# Altium schematic sheet Sheet0-mcu.SchDoc
size A3; SheetNumber: 1; SheetTotal: 2
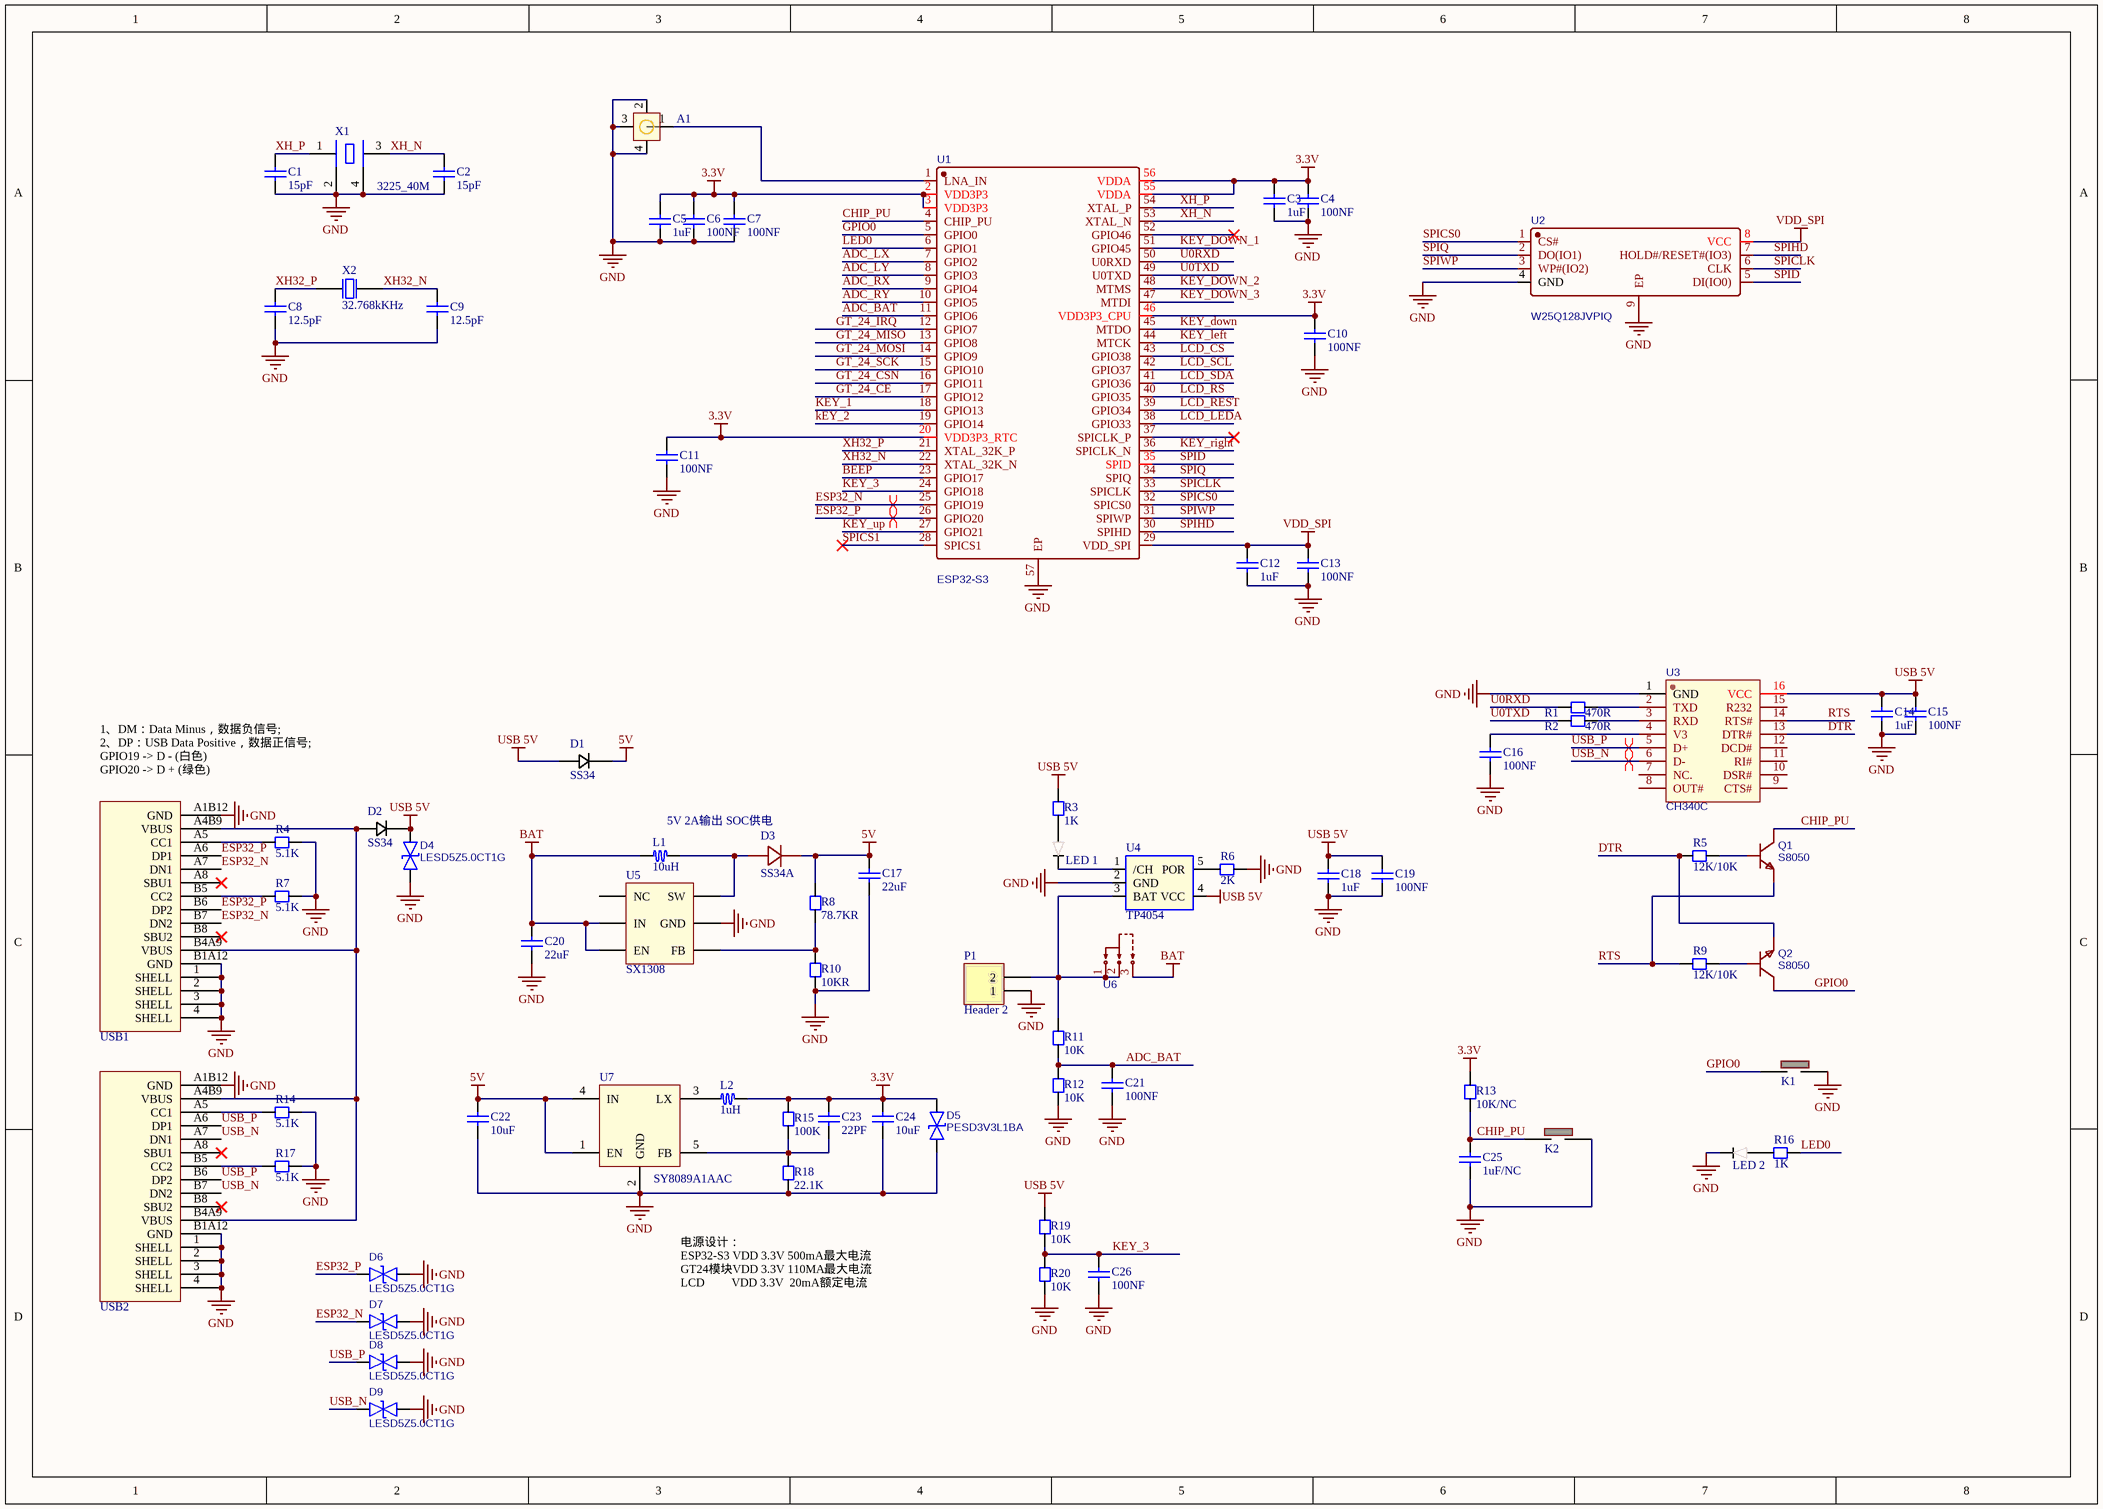
[diagram p0: Sheet0-mcu.SchDoc]

## Parts
A1  ANT-IPEX  [ANT-IPEX]  (value not drawn)
C1  15pF  [CC1608-0603]
C2  15pF  [CC1608-0603]
C3  1uF  [CC1608-0603]
C4  100NF  [CC1608-0603]
C5  1uF  [CC1608-0603]
C6  100NF  [CC1608-0603]
C7  100NF  [CC1608-0603]
C8  12.5pF  [CC1608-0603]
C9  12.5pF  [CC1608-0603]
C10  100NF  [CC1608-0603]
C11  100NF  [CC1608-0603]
C12  1uF  [CC1608-0603]
C13  100NF  [CC1608-0603]
C14  1uF  [CC1608-0603]
C15  100NF  [CC1608-0603]
C16  100NF  [CC1608-0603]
C17  22uF  [CC1608-0603]
C18  1uF  [CC1608-0603]
C19  100NF  [CC1608-0603]
C20  22uF  [CC1608-0603]
C21  100NF  [CC1608-0603]
C22  10uF  [CC1608-0603]
C23  22PF  [CC1608-0603]
C24  10uF  [CC1608-0603]
C25  1uF/NC  [CC1608-0603]
C26  100NF  [CC1608-0603]
D1  SS34  [DO-214 AA]
D2  SS34  [DO-214 AA]
D3  SS34A  [DO-214 AA SMB]
D4  LESD5Z5.0CT1G  [SOD-523]
D5  PESD3V3L1BA  [SOD-323]
D6  LESD5Z5.0CT1G  [SOD-523]
D7  LESD5Z5.0CT1G  [SOD-523]
D8  LESD5Z5.0CT1G  [SOD-523]
D9  LESD5Z5.0CT1G  [SOD-523]
K1  KEY 3*4  [KEY 3*4]  (value not drawn)
K2  KEY 3*4  [KEY 3*4]  (value not drawn)
L1  10uH  [Inductor-6045]
L2  1uH  [Inductor-4018]
LED_1  LED 0603  [LED 0603]  (value not drawn)
LED_2  LED 0603  [LED 0603]  (value not drawn)
P1  Header 2  [HX2.54-2]
Q1  S8050  [SOT-23]
Q2  S8050  [SOT-23]
R1  470R  [CR1608-0603]
R2  470R  [CR1608-0603]
R3  1K  [CR1608-0603]
R4  5.1K  [CR1608-0603]
R5  12K/10K  [CR1608-0603]
R6  2K  [CR1608-0603]
R7  5.1K  [CR1608-0603]
R8  78.7KR  [CR1608-0603]
R9  12K/10K  [CR1608-0603]
R10  10KR  [CR1608-0603]
R11  10K  [CR1608-0603]
R12  10K  [CR1608-0603]
R13  10K/NC  [CR1608-0603]
R14  5.1K  [CR1608-0603]
R15  100K  [CR1608-0603]
R16  1K  [CR1608-0603]
R17  5.1K  [CR1608-0603]
R18  22.1K  [CR1608-0603]
R19  10K  [CR1608-0603]
R20  10K  [CR1608-0603]
U1  ESP32-S3  [QFN-56]
U2  W25Q128JVPIQ  [WSON-8]
U3  CH340C  [SOP-16]
U4  TP4054  [SOT23-5]
U5  SX1308  [SOT23-6]
U6  HX SS12D10G4  [SW-TH_3P-SS12D06]  (value not drawn)
U7  SY8089A1AAC  [SOT23-5]
USB1  Tpye-c 16P  [TYPE-C 16P]  (value not drawn)
USB2  Tpye-c 16P  [TYPE-C 16P]  (value not drawn)
X1  3225_40M  [XTAL-3225]
X2  32.768kKHz  [XTAL-3215]

## Nets
3.3V: C3.2 C4.2 C5.2 C6.2 C7.2 C10.2 C11.2 C23.2 C24.2 D5.1 L2.2 R13.2 R15.1 U1.2(VDD3P3) U1.3(VDD3P3) U1.20(VDD3P3_RTC) U1.46(VDD3P3_CPU) U1.55(VDDA) U1.56(VDDA)
5V: C17.1 C22.2 D1.1(K) D3.1(C) R8.2 U7.1(EN) U7.4(IN)
BAT: C20.2 L1.1 U5.4(EN) U5.5(IN) U6.3
GND: A1.2 A1.3 A1.4 C1.1 C2.1 C3.1 C4.1 C5.1 C6.1 C7.1 C8.1 C9.1 C10.1 C11.1 C12.1 C13.1 C14.1 C15.1 C16.1 C17.2 C18.1 C19.1 C20.1 C21.1 C22.1 C24.1 C25.1 C26.1 D4.2 D5.2 D6.2 D7.2 D8.2 D9.2 K1.2 K2.2 LED_2.2 P1.1 R4.1 R6.2 R7.1 R10.1 R12.1 R14.1 R17.1 R18.2 R20.1 U1.57(EP) U2.4(GND) U2.9(EP) U3.1(GND) U4.2(GND) U5.2(GND) U7.2(GND) USB1.1(SHELL) USB1.2(SHELL) USB1.3(SHELL) USB1.4(SHELL) USB1.A1B12(GND) USB1.B1A12(GND) USB2.1(SHELL) USB2.2(SHELL) USB2.3(SHELL) USB2.4(SHELL) USB2.A1B12(GND) USB2.B1A12(GND) X1.2(GND) X1.4(GND)
USB 5V: C14.2 C15.2 C18.2 C19.2 D1.2(A) D2.1(K) D4.1 R3.1 R19.2 U3.16(VCC) U4.4(VCC)
VDD_SPI: C12.2 C13.2 U1.29(VDD_SPI) U2.8(VCC)
ADC_BAT: C21.2 R11.1 R12.2 U1.11(GPIO6)
ADC_LX: U1.7(GPIO2)
ADC_LY: U1.8(GPIO3)
ADC_RX: U1.9(GPIO4)
ADC_RY: U1.10(GPIO5)
BEEP: U1.23(GPIO17)
CHIP_PU: C25.2 K2.1 Q1.3(C) R13.1 U1.4(CHIP_PU)
DTR: Q2.2(E) R5.1 U3.13(DTR#)
ESP32_N: D7.1 U1.25(GPIO19) USB1.A7(DN1) USB1.B7(DN2)
ESP32_P: D6.1 U1.26(GPIO20) USB1.A6(DP1) USB1.B6(DP2)
GPIO0: K1.1 Q2.3(C) U1.5(GPIO0)
GT_24_CE: U1.17(GPIO12)
GT_24_CSN: U1.16(GPIO11)
GT_24_IRQ: U1.12(GPIO7)
GT_24_MISO: U1.13(GPIO8)
GT_24_MOSI: U1.14(GPIO9)
GT_24_SCK: U1.15(GPIO10)
KEY_1: U1.18(GPIO13)
kEY_2: U1.19(GPIO14)
KEY_3: C26.2 R19.1 R20.2 U1.24(GPIO18)
KEY_down: U1.45(MTDO)
KEY_DOWN_1: U1.51(GPIO45)
KEY_DOWN_2: U1.48(MTMS)
KEY_DOWN_3: U1.47(MTDI)
KEY_left: U1.44(MTCK)
KEY_right: U1.36(SPICLK_N)
KEY_up: U1.27(GPIO21)
LCD_CS: U1.43(GPIO38)
LCD_LEDA: U1.38(GPIO33)
LCD_REST: U1.39(GPIO34)
LCD_RS: U1.40(GPIO35)
LCD_SCL: U1.42(GPIO37)
LCD_SDA: U1.41(GPIO36)
LED0: R16.1 U1.6(GPIO1)
RTS: Q1.2(E) R9.1 U3.14(RTS#)
SPICLK: U1.33(SPICLK) U2.6(CLK)
SPICS0: U1.32(SPICS0) U2.1(CS#)
SPICS1: U1.28(SPICS1)
SPID: U1.35(SPID) U2.5(DI(IO0))
SPIHD: U1.30(SPIHD) U2.7(HOLD#/RESET#(IO3))
SPIQ: U1.34(SPIQ) U2.2(DO(IO1))
SPIWP: U1.31(SPIWP) U2.3(WP#(IO2))
U0RXD: R1.2 U1.50(U0RXD)
U0TXD: R2.2 U1.49(U0TXD)
USB_N: D9.1 U3.6(D-) USB2.A7(DN1) USB2.B7(DN2)
USB_P: D8.1 U3.5(D+) USB2.A6(DP1) USB2.B6(DP2)
XH32_N: C9.2 U1.22(XTAL_32K_N) X2.2(OSC2)
XH32_P: C8.2 U1.21(XTAL_32K_P) X2.1(OSC1)
XH_N: C2.2 U1.53(XTAL_N) X1.3(OSC2)
XH_P: C1.2 U1.54(XTAL_P) X1.1(OSC1)
NetA1_1: A1.1 U1.1(LNA_IN)
NetC16_2: C16.2 U3.4(V3)
NetC23_1: C23.1 R15.2 R18.1 U7.5(FB)
NetD2_2: D2.2(A) USB1.A4B9(VBUS) USB1.B4A9(VBUS) USB2.A4B9(VBUS) USB2.B4A9(VBUS)
NetD3_2: D3.2(A) L1.2 U5.1(SW)
NetL2_1: L2.1 U7.3(LX)
NetLED_1_1: LED_1.1 R3.2
NetLED_1_2: LED_1.2 U4.1(/CH)
NetLED_2_1: LED_2.1 R16.2
NetP1_2: P1.2 R11.2 U4.3(BAT) U6.1 U6.2
NetQ1_1: Q1.1(B) R5.2
NetQ2_1: Q2.1(B) R9.2
NetR1_1: R1.1 U3.2(TXD)
NetR2_1: R2.1 U3.3(RXD)
NetR4_2: R4.2 USB1.A5(CC1)
NetR6_1: R6.1 U4.5(POR)
NetR7_2: R7.2 USB1.B5(CC2)
NetR8_1: R8.1 R10.2 U5.3(FB)
NetR14_2: R14.2 USB2.A5(CC1)
NetR17_2: R17.2 USB2.B5(CC2)

Not connected (* = marked no-connect by the designer): U1 37(SPICLK_P)* 52(GPIO46)*; U3 7(NC.) 8(OUT#) 9(CTS#) 10(DSR#) 11(RI#) 12(DCD#) 15(R232); U5 6(NC); USB1 A8(SBU1)* B8(SBU2)*; USB2 A8(SBU1)* B8(SBU2)*

## Layout directives
differential pair: ESP32_N, ESP32_P, USB_N, USB_P

## Notes on the sheet
- 1、DM：Data Minus，数据负信号;
  2、DP：USB Data Positive，数据正信号;
  GPIO19 -> D - (白色)
  GPIO20 -> D + (绿色)
- 5V 2A输出 SOC供电
- 电源设计：
  ESP32-S3 VDD 3.3V 500mA最大电流
  GT24模块VDD 3.3V 110MA最大电流
  LCD         VDD 3.3V  20mA额定电流

## Library data of the parts
A1 = ANT-IPEX: 贴片封装的天线 封装类型为IPEX
C1-C16 C18-C26 = Cap Chip 0603: 0603封装的电容; Published: 8-Jun-2000; Revision: July-2002: Re-released for DXP Platform.; Publisher: Altium Limited
C17 = Chip capacitor: 贴片电容
D1 D2 = SS34: 肖特基二极管
D3 = SS34A: 大电流肖特基二极管，5A/40V
D4 D6-D9 = LESD5Z5.0CT1G: SOD-523 ESD防静电二极管保护芯片; Manufacturer: MDD; Manufacturer Part: SMAJ6.5CA; Supplier: LCSC; Supplier Part: C110041; JLCPCB Part Class: Extended Part; spicePre: D; spiceSymbolName: SMAJ6.5CA-C110041
D5 = PESD3V3L1BA: SOD-323 3.3V 双向ESD防静电二极管保护芯片; Manufacturer: MDD; Manufacturer Part: SMAJ6.5CA; Supplier: LCSC; Supplier Part: C110041; JLCPCB Part Class: Extended Part; spicePre: D; spiceSymbolName: SMAJ6.5CA-C110041
K1 K2 = KEY 3*4: 轻触开关按键
L1 = Inductor-6045: 6045封装 线绕SMD功率电感
L2 = Inductor-4018: 贴片电感 1206封装
P1 = Header 2: Header, 2-Pin; LatestRevisionDate: 17-Jul-2002; LatestRevisionNote: Re-released for DXP Platform.; Publisher: Altium Limited
Q1 Q2 = S8050: Manufacturer: SALLTECH(萨瑞); Contributor: lcsc; Supplier: LCSC; Supplier Part: C3027096; Manufacturer Part: S8050; spicePre: Q; spiceSymbolName: S8050_C3027096
R1-R7 R9 R11-R20 = Resistor Chip 0603: 0603封装电阻; Published: 8-Jun-2000; Revision: July-2002: Re-released for DXP Platform.; Publisher: Altium Limited
R8 R10 = Chip resistor: 贴片电阻
U1 = ESP32-S3: Manufacturer: ESPRESSIF(乐鑫); Contributor: LCSC; Supplier: LCSC; Supplier Part: C2913192; Manufacturer Part: ESP32-S3; JLCPCB Part Class: Extended Part; spicePre: U; spiceSymbolName: ESP32-S3
U2 = W25Q128JVPIQ: Manufacturer: WINBOND(华邦); Contributor: LCSC; Supplier: LCSC; Supplier Part: C2803379; Manufacturer Part: W25Q128JVPIQ; JLCPCB Part Class: Extended Part; spicePre: U; spiceSymbolName: W25Q128JVPIQ
U3 = CH340C: Manufacturer: WCH(南京沁恒); Supplier: LCSC; Manufacturer Part: CH340C; Supplier Part: C84681; JLCPCB Part Class: Extended Part; spicePre: U; spiceSymbolName: CH340C
U4 = TP4054: 迷你充电IC SOT-23-5
U5 = SX1308: SOT23-6 升压芯片
U6 = SW-TH_3P-SS12D06: BOM_Manufacturer: hanxia(韩下); Contributor: lcsc; BOM_Supplier: LCSC; BOM_Supplier Part: C5149841; BOM_Manufacturer Part: HX SS12D10G4; link: https://atta.szlcsc.com/upload/public/pdf/source/20220907/2020D7183ED16DD6E2B9F5A13FB144CF.pdf; BOM_JLCPCB Part Class: Extended Part; spicePre: U; spiceSymbolName: HX SS12D10G4
U7 = SY8089A1AAC: SY8089A1是一种高效率的1.5MHz同步降压DC/DC稳压器，能够提供高达输出电流2A。它可以在2.5V到5.5V的宽输入电压范围内工作，集成了主开关和同步开关，具有极低的RDS(ON)，最大限度地减少了导通损耗。 / 输出电压纹波小，外接电感小，电容器尺寸小 / 1.5MHz开关频率。
USB1 USB2 = Tpye-c 16P: 16P 封装的TYPE -c接口 4固定插脚 双向
X1 = XTAL 3225: 3225封装的晶振
X2 = XTAL 3215 32.768kKHz: 3215封装的时钟晶振